# Altium schematic sheet MAGIsCM4Core.SchDoc
size A4
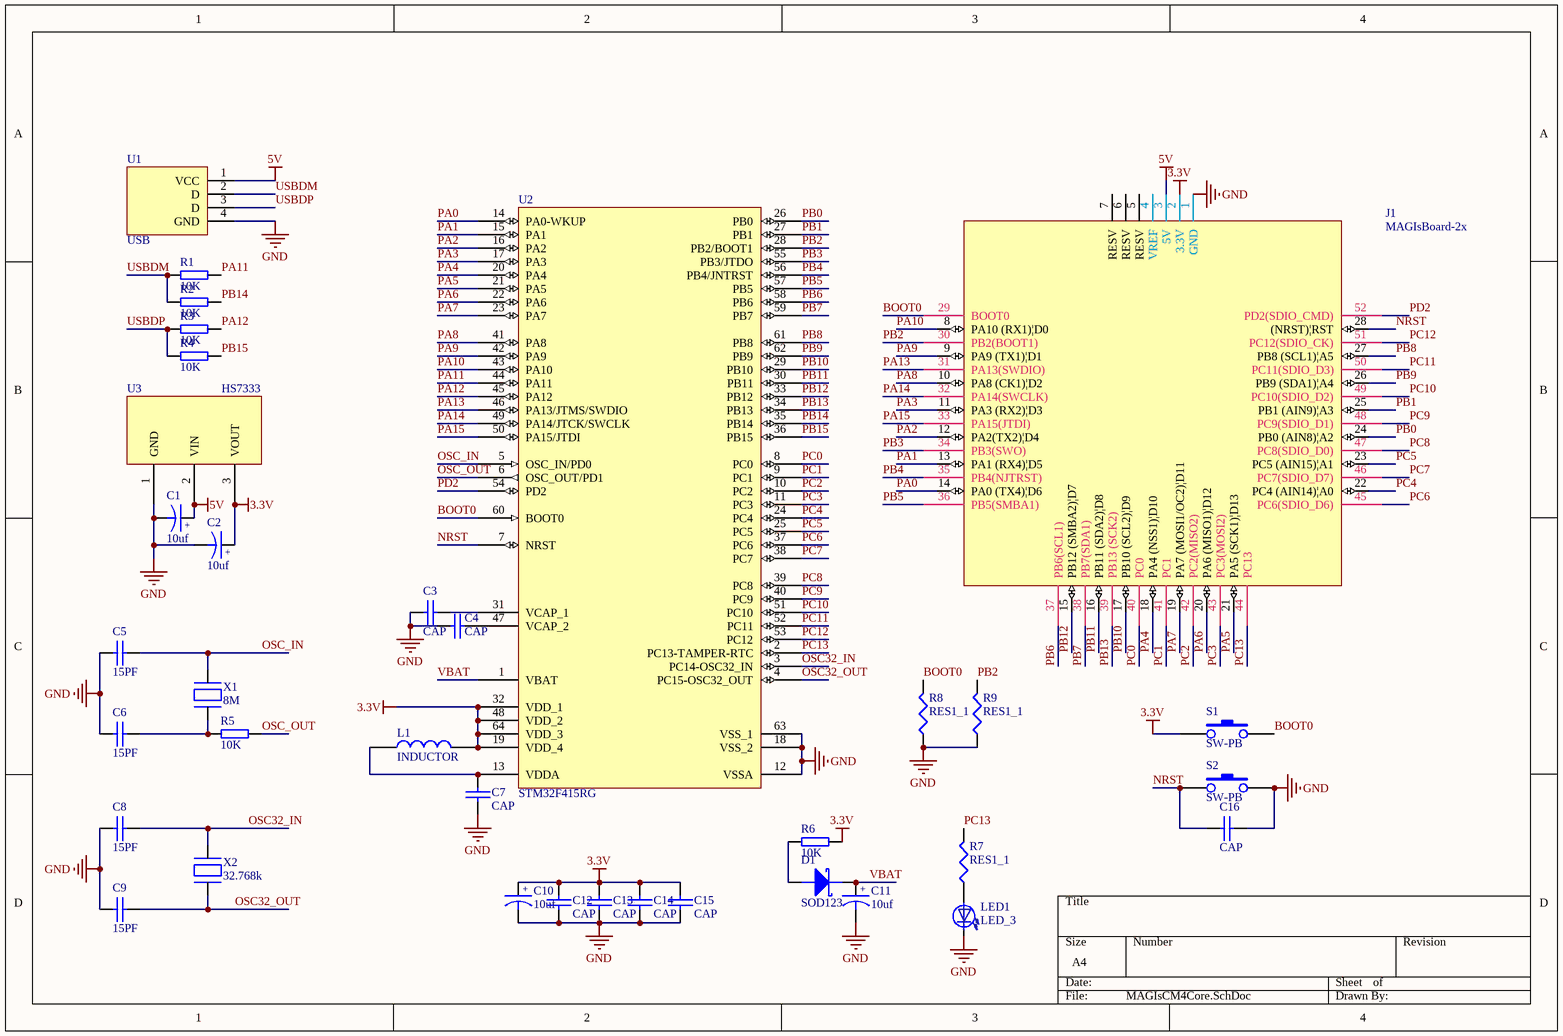
[diagram p0: MAGIsCM4Core.SchDoc]

## Parts
C1  10uf  [6-0805_n]
C2  10uf  [6-0805_n]
C3  CAP  [6-0805_N]
C4  CAP  [6-0805_N]
C5  15PF  [6-0805_n]
C6  15PF  [6-0805_n]
C7  CAP  [6-0805_N]
C8  15PF  [1608[0603]]
C9  15PF  [1608[0603]]
C10  10uf  [C1210_N]
C11  10uf  [3.3V0.2F-RK]
C12  CAP  [6-0805_N]
C13  CAP  [6-0805_N]
C14  CAP  [6-0805_N]
C15  CAP  [6-0805_N]
C16  CAP  [6-0805_N]
D1  SOD123  [LL34]
J1  MAGIsBoard-2x  [MAGIsBoard-2x]
L1  INDUCTOR  [6-0805_n]
LED1  LED_3  [6-0805_N]
R1  10K  [6-0805_n]
R2  10K  [6-0805_n]
R3  10K  [6-0805_n]
R4  10K  [6-0805_n]
R5  10K  [6-0805_n]
R6  10K  [6-0805_n]
R7  RES1_1  [6-0805_N]
R8  RES1_1  [6-0805_N]
R9  RES1_1  [6-0805_N]
S1  SW-PB  [SKRELGE010]
S2  SW-PB  [SKRELGE010]
U1  USB  [microUSB]
U2  STM32F415RG  [STM32F415RG]
U3  HS7333  [HS7333]
X1  8M  [5032]
X2  32.768k  [3215]

## Nets
3.3V: C2.1 C10.1 C12.2 C13.2 C14.2 C15.2 J1.2(3.3V) L1.2 R6.1 S1.1 U2.19(VDD_4) U2.32(VDD_1) U2.48(VDD_2) U2.64(VDD_3) U3.3(VOUT)
5V: C1.1 J1.3(5V) U1.1(VCC) U3.2(VIN)
GND: C1.2 C2.2 C3.1 C4.1 C5.1 C6.1 C7.2 C8.1 C9.1 C10.2 C11.2 C12.1 C13.1 C14.1 C15.1 C16.1 J1.1(GND) LED1.2(K) R8.1 R9.1 S2.2 U1.4(GND) U2.12(VSSA) U2.18(VSS_2) U2.63(VSS_1) U3.1(GND)
BOOT0: J1.29(BOOT0) R8.2 S1.2 U2.60(BOOT0)
NRST: C16.2 J1.28((NRST)|RST) S2.1 U2.7(NRST)
OSC32_IN: C8.2 U2.3(PC14-OSC32_IN) X2.1
OSC32_OUT: C9.2 U2.4(PC15-OSC32_OUT) X2.2
OSC_IN: C5.2 U2.5(OSC_IN/PD0) X1.1
OSC_OUT: R5.1 U2.6(OSC_OUT/PD1)
PA0: J1.14(PA0_(TX4)|D6) U2.14(PA0-WKUP)
PA1: J1.13(PA1_(RX4)|D5) U2.15(PA1)
PA2: J1.12(PA2(TX2)|D4) U2.16(PA2)
PA3: J1.11(PA3_(RX2)|D3) U2.17(PA3)
PA4: J1.18(PA4_(NSS1)|D10) U2.20(PA4)
PA5: J1.21(PA5_(SCK1)|D13) U2.21(PA5)
PA6: J1.20(PA6_(MISO1)|D12) U2.22(PA6)
PA7: J1.19(PA7_(MOSI1/OC2)|D11) U2.23(PA7)
PA8: J1.10(PA8_(CK1)|D2) U2.41(PA8)
PA9: J1.9(PA9_(TX1)|D1) U2.42(PA9)
PA10: J1.8(PA10_(RX1)|D0) U2.43(PA10)
PA11: R1.1 U2.44(PA11)
PA12: R3.1 U2.45(PA12)
PA13: J1.31(PA13(SWDIO)) U2.46(PA13/JTMS/SWDIO)
PA14: J1.32(PA14(SWCLK)) U2.49(PA14/JTCK/SWCLK)
PA15: J1.33(PA15(JTDI)) U2.50(PA15/JTDI)
PB0: J1.24(PB0_(AIN8)|A2) U2.26(PB0)
PB1: J1.25(PB1_(AIN9)|A3) U2.27(PB1)
PB2: J1.30(PB2(BOOT1)) R9.2 U2.28(PB2/BOOT1)
PB3: J1.34(PB3(SWO)) U2.55(PB3/JTDO)
PB4: J1.35(PB4(NJTRST)) U2.56(PB4/JNTRST)
PB5: J1.36(PB5(SMBA1)) U2.57(PB5)
PB6: J1.37(PB6(SCL1)) U2.58(PB6)
PB7: J1.38(PB7(SDA1)) U2.59(PB7)
PB8: J1.27(PB8_(SCL1)|A5) U2.61(PB8)
PB9: J1.26(PB9_(SDA1)|A4) U2.62(PB9)
PB10: J1.17(PB10_(SCL2)|D9) U2.29(PB10)
PB11: J1.16(PB11_(SDA2)|D8) U2.30(PB11)
PB12: J1.15(PB12_(SMBA2)|D7) U2.33(PB12)
PB13: J1.39(PB13_(SCK2)) U2.34(PB13)
PB14: R2.1 U2.35(PB14)
PB15: R4.1 U2.36(PB15)
PC0: J1.40(PC0) U2.8(PC0)
PC1: J1.41(PC1) U2.9(PC1)
PC2: J1.42(PC2(MISO2)) U2.10(PC2)
PC3: J1.43(PC3(MOSI2)) U2.11(PC3)
PC4: J1.22(PC4_(AIN14)|A0) U2.24(PC4)
PC5: J1.23(PC5_(AIN15)|A1) U2.25(PC5)
PC6: J1.45(PC6(SDIO_D6)) U2.37(PC6)
PC7: J1.46(PC7(SDIO_D7)) U2.38(PC7)
PC8: J1.47(PC8(SDIO_D0)) U2.39(PC8)
PC9: J1.48(PC9(SDIO_D1)) U2.40(PC9)
PC10: J1.49(PC10(SDIO_D2)) U2.51(PC10)
PC11: J1.50(PC11(SDIO_D3)) U2.52(PC11)
PC12: J1.51(PC12(SDIO_CK)) U2.53(PC12)
PC13: J1.44(PC13) R7.2 U2.2(PC13-TAMPER-RTC)
PD2: J1.52(PD2(SDIO_CMD)) U2.54(PD2)
USBDM: R1.2 R2.2 U1.2(D)
USBDP: R3.2 R4.2 U1.3(D)
VBAT: C11.1 D1.2(K) U2.1(VBAT)
NetC3_2: C3.2 U2.31(VCAP_1)
NetC4_2: C4.2 U2.47(VCAP_2)
NetC6_2: C6.2 R5.2 X1.2
NetC7_1: C7.1 L1.1 U2.13(VDDA)
NetD1_1: D1.1(A) R6.2
NetLED1_1: LED1.1(A) R7.1

Not connected (* = marked no-connect by the designer): J1 4(VREF) 5(RESV) 6(RESV) 7(RESV)

## Notes on the sheet
- (in symbol CAPACITOR POL) +

## Library data of the parts
C1 C2 C10 C11 = CAPACITOR POL: Capacitor
C3 C4 C7 C12-C16 = CAP_1: Capacitor
C5 C6 C8 C9 = CAP
D1 = DIODE SCHOTTKY_1: Schottky Diode
R1-R6 = RES
X1 X2 = CRYSTAL